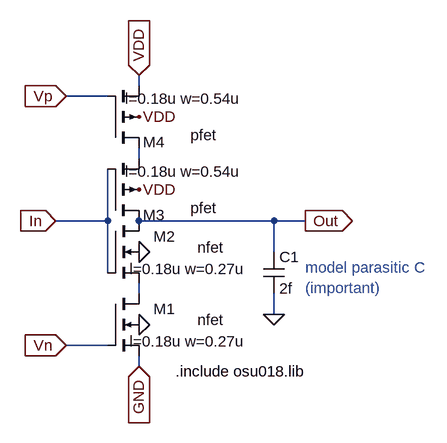
[diagram p0: schematic CS_inv.asc]
CS_inv.asc, the LTspice schematic file:
Version 4
SHEET 1 6288 680
WIRE 656 -496 656 -512
WIRE 608 -480 544 -480
WIRE 656 -384 656 -400
WIRE 608 -288 608 -368
WIRE 608 -288 528 -288
WIRE 864 -288 656 -288
WIRE 912 -288 864 -288
WIRE 864 -240 864 -288
WIRE 608 -208 608 -288
WIRE 656 -176 656 -192
WIRE 864 -144 864 -176
WIRE 608 -96 544 -96
WIRE 656 -64 656 -80
FLAG 656 -128 0
FLAG 656 -448 VDD
FLAG 656 -336 VDD
FLAG 656 -240 0
FLAG 656 -512 VDD
IOPIN 656 -512 In
FLAG 528 -288 In
IOPIN 528 -288 In
FLAG 544 -480 Vp
IOPIN 544 -480 In
FLAG 544 -96 Vn
IOPIN 544 -96 In
FLAG 912 -288 Out
IOPIN 912 -288 Out
FLAG 656 -64 GND
IOPIN 656 -64 In
FLAG 864 -144 0
SYMBOL nmos4 608 -176 R0
WINDOW 0 104 24 Right 2
WINDOW 3 179 41 Right 2
WINDOW 123 213 74 Right 2
SYMATTR InstName M1
SYMATTR Value nfet
SYMATTR Value2 l=0.18u w=0.27u
SYMBOL pmos4 608 -400 M180
WINDOW 0 88 9 Right 2
WINDOW 3 168 20 Right 2
WINDOW 123 206 76 Right 2
SYMATTR InstName M4
SYMATTR Value pfet
SYMATTR Value2 l=0.18u w=0.54u
SYMBOL pmos4 608 -288 M180
WINDOW 0 88 9 Right 2
WINDOW 3 168 20 Right 2
WINDOW 123 206 76 Right 2
SYMATTR InstName M3
SYMATTR Value pfet
SYMATTR Value2 l=0.18u w=0.54u
SYMBOL nmos4 608 -288 R0
WINDOW 0 104 24 Right 2
WINDOW 3 179 41 Right 2
WINDOW 123 213 74 Right 2
SYMATTR InstName M2
SYMATTR Value nfet
SYMATTR Value2 l=0.18u w=0.27u
SYMBOL cap 848 -240 R0
SYMATTR InstName C1
SYMATTR Value 2f
TEXT 712 -56 Left 2 !.include osu018.lib
TEXT 912 -216 Left 2 ;model parasitic C\n(important)

The netlist it stands for:
* CS_inv.asc
M1 N002 Vn GND 0 nfet l=0.18u w=0.27u
M4 N001 Vp VDD VDD pfet l=0.18u w=0.54u
M3 Out In N001 VDD pfet l=0.18u w=0.54u
M2 Out In N002 0 nfet l=0.18u w=0.27u
C1 Out 0 2f
.model NMOS NMOS
.model PMOS PMOS
.lib standard.mos
.include osu018.lib
* model parasitic C
* (important)
.backanno
.end